# Altium project CtrlCarbinBoard.PrjPCB
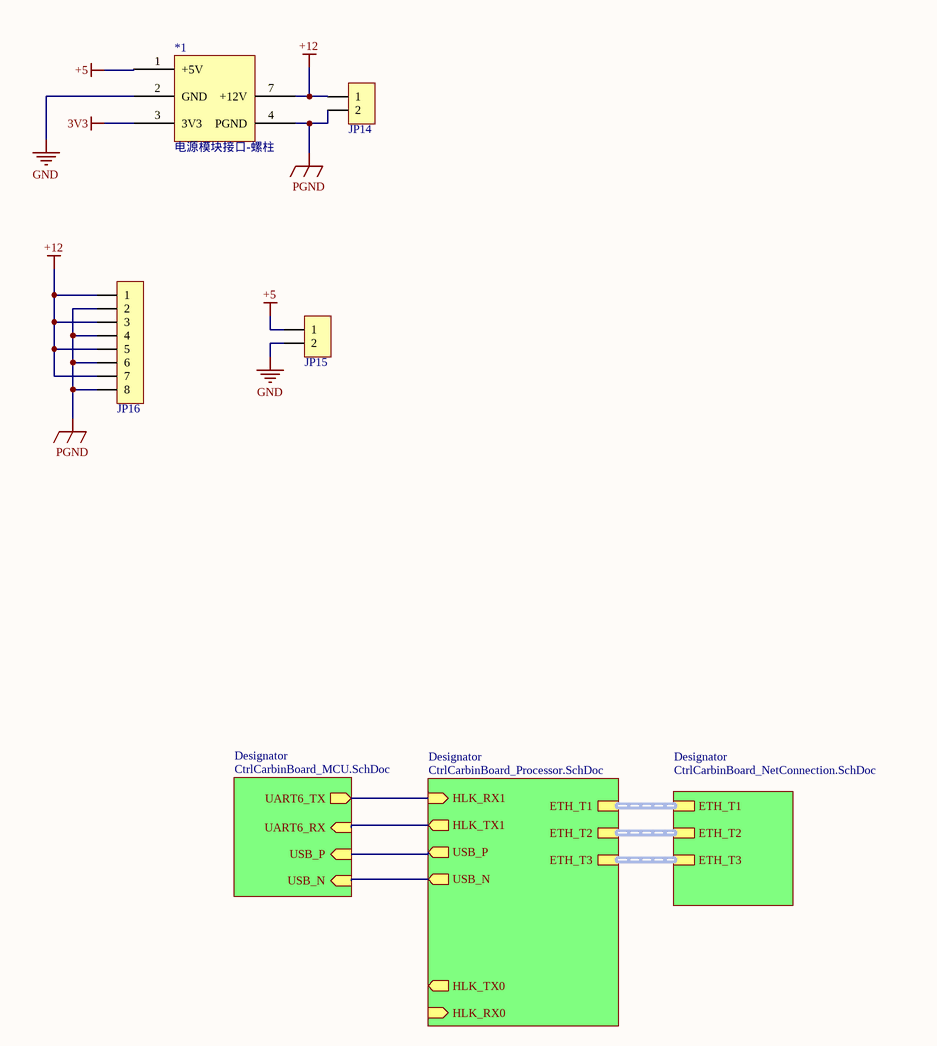
[diagram p0: CtrlCarbinBoard_Common.SchDoc]
4 sheets, 91 parts. Net scope: hierarchical (ports join the sheet entries above them; power ports are global).
Board file: CtrlCarbinBoard.PcbDoc
Sheets:
  CtrlCarbinBoard_Common.SchDoc
    Designator = CtrlCarbinBoard_MCU.SchDoc
    Designator = CtrlCarbinBoard_NetConnection.SchDoc
    Designator = CtrlCarbinBoard_Processor.SchDoc

## Sheet CtrlCarbinBoard_Common.SchDoc
size A3

### Parts
*1  电源模块接口-螺柱  [螺柱-座 5]
JP14  HDR-1X2  [KF128-5.08-2P]  (value not drawn)
JP15  HDR-1X2  [KF128-5.08-2P]  (value not drawn)
JP16  HDR-1X8  [KF128-5.08-8P]  (value not drawn)

### Sub-sheets
Designator = CtrlCarbinBoard_MCU.SchDoc: UART6_TX (out), USB_P (in), USB_N (in), UART6_RX (in)
Designator = CtrlCarbinBoard_NetConnection.SchDoc: ETH_T2 (harness ETH_T2), ETH_T3 (harness ETH_T3), ETH_T1 (harness ETH_T1)
Designator = CtrlCarbinBoard_Processor.SchDoc: HLK_TX0 (out), USB_P (out), HLK_RX1 (in), HLK_RX0 (in), USB_N (out), HLK_TX1 (out), ETH_T2 (harness ETH_T2), ETH_T3 (harness ETH_T3), ETH_T1 (harness ETH_T1)

### Nets
3V3: *1.3(3V3)
+5: *1.1(+5V) JP15.1
+12: *1.7(+12V) JP14.1 JP16.1 JP16.3 JP16.5 JP16.7
GND: *1.2(GND) JP15.2
PGND: *1.4(PGND) JP14.2 JP16.2 JP16.4 JP16.6 JP16.8
RX1: sheet Designator/UART6_TX, sheet Designator/HLK_RX1
TX1: sheet Designator/UART6_RX, sheet Designator/HLK_TX1
USB_D_N: sheet Designator/USB_N, sheet Designator/USB_N
USB_D_P: sheet Designator/USB_P, sheet Designator/USB_P

### Library data of the parts
JP14 JP15 = Header 2: 2P接插件; 版权归属: 源创客; BOM名称: 2P接插件; 学习资源: www.ooocke.com
JP16 = Header 8: 8P接插件; 版权归属: 源创客; BOM名称: 8P接插件; 学习资源: www.ooocke.com

## Sheet CtrlCarbinBoard_MCU.SchDoc
size A3
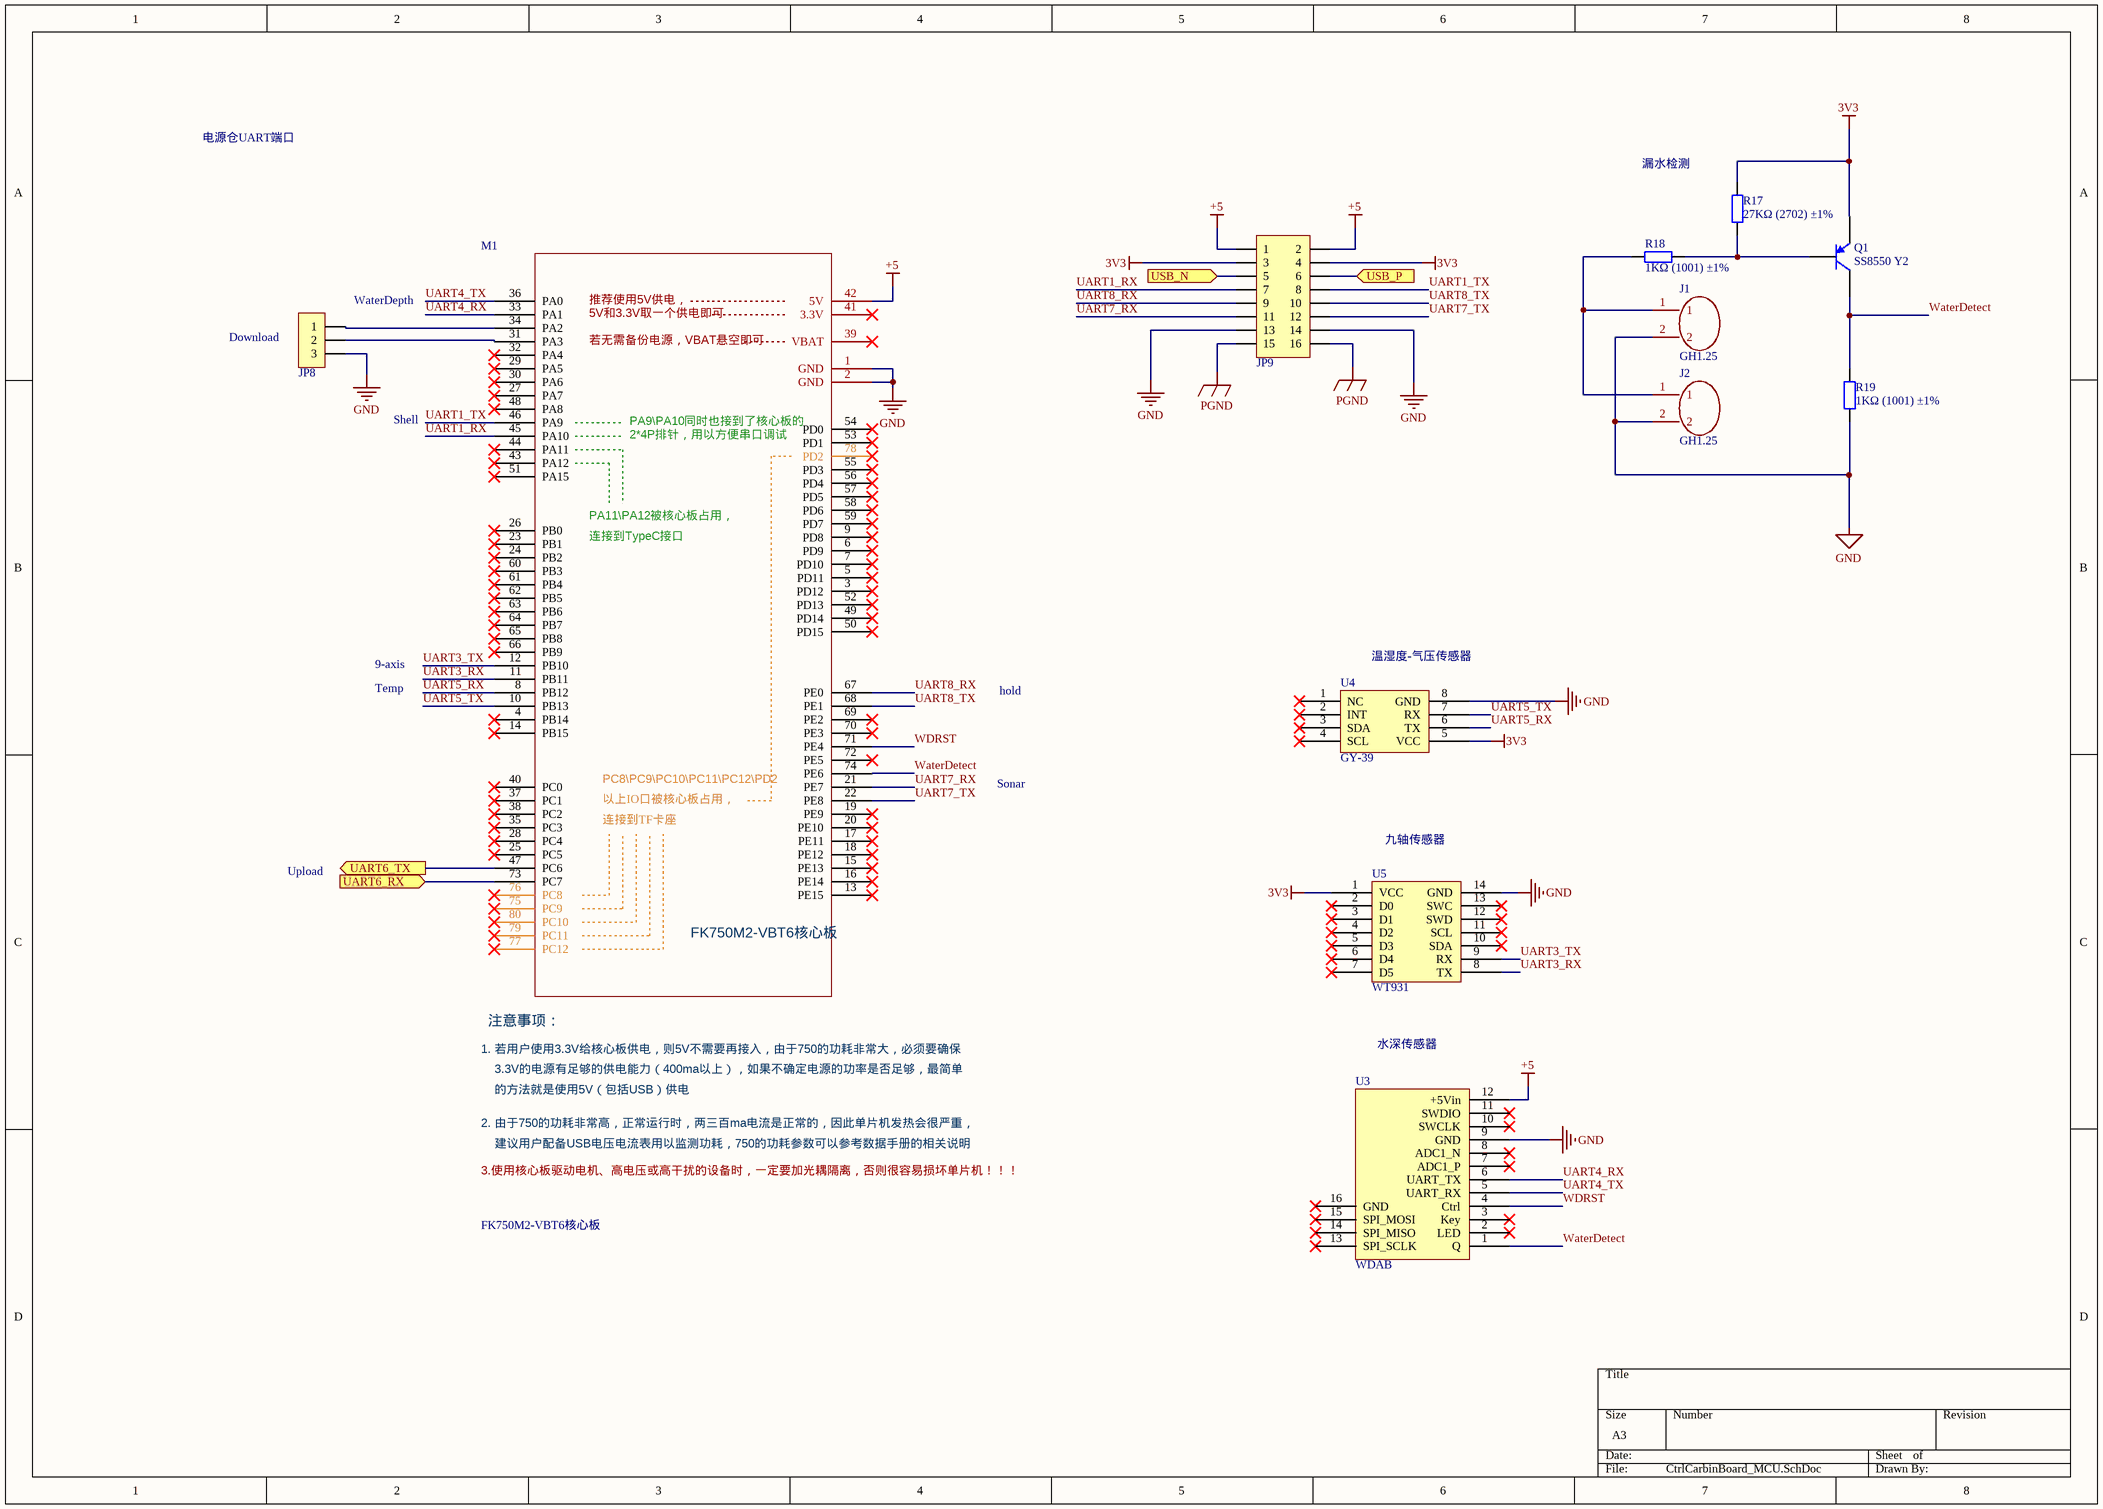
[diagram p1: CtrlCarbinBoard_MCU.SchDoc]

### Parts
J1  GH1.25  [GH1.25 2pin]
J2  GH1.25  [GH1.25 2pin]
JP8  HDR-1X3  [PH2.0-LS-3P]  (value not drawn)
JP9  Header 8X2  [IDC2.54-LI-2x8P]  (value not drawn)
M1  FK750M2-VBT6核心板  [FK750M2-VBT6(精简版)]
Q1  SS8550 Y2  [SOT-23(SOT-23-3)]
R17  27KΩ (2702) ±1%  [0603_R]
R18  1KΩ (1001) ±1%  [0603_R]
R19  1KΩ (1001) ±1%  [0603_R]
U3  WDAB  [WaterDepthBoard]
U4  GY-39  [GY39]
U5  WT931  [WT931]

### Ports
UART6_RX (in), UART6_TX (out), USB_N (in), USB_P (in)

### Nets
3V3: JP9.3 JP9.4 Q1.2(E) R17.2 U4.5(VCC) U5.1(VCC)
+5: JP9.1 JP9.2 M1.42(5V) U3.12(+5Vin)
GND: J1.2 J2.2 JP8.3 JP9.13 JP9.14 M1.1(GND) M1.2(GND) R19.1 U3.9(GND) U4.8(GND) U5.14(GND)
PGND: JP9.15 JP9.16
RX1: M1.47(PC6) ; port UART6_TX
TX1: M1.73(PC7) ; port UART6_RX
UART1_RX: JP9.7 M1.45(PA10)
UART1_TX: JP9.8 M1.46(PA9)
UART3_RX: M1.11(PB11) U5.8(TX)
UART3_TX: M1.12(PB10) U5.9(RX)
UART4_RX: M1.33(PA1) U3.6(UART_TX)
UART4_TX: M1.36(PA0) U3.5(UART_RX)
UART5_RX: M1.8(PB12) U4.6(TX)
UART5_TX: M1.10(PB13) U4.7(RX)
UART7_RX: JP9.11 M1.21(PE7)
UART7_TX: JP9.12 M1.22(PE8)
UART8_RX: JP9.9 M1.67(PE0)
UART8_TX: JP9.10 M1.68(PE1)
USB_D_N: JP9.5 ; port USB_N
USB_D_P: JP9.6 ; port USB_P
WaterDetect: M1.74(PE6) Q1.3(C) R19.2 U3.1(Q)
WDRST: M1.71(PE4) U3.4(Ctrl)
NetJ1_1: J1.1 J2.1 R18.1
NetJP8_1: JP8.1 M1.34(PA2)
NetJP8_2: JP8.2 M1.31(PA3)
NetQ1_1: Q1.1(B) R17.1 R18.2

Not connected (* = marked no-connect by the designer): M1 3(PD12)* 4(PB14)* 5(PD11)* 6(PD9)* 7(PD10)* 9(PD8)* 13(PE15)* 14(PB15)* 15(PE13)* 16(PE14)* 17(PE11)* 18(PE12)* 19(PE9)* 20(PE10)* 23(PB1)* 24(PB2)* 25(PC5)* 26(PB0)* 27(PA7)* 28(PC4)* 29(PA5)* 30(PA6)* 32(PA4)* 35(PC3)* 37(PC1)* 38(PC2)* 39(VBAT)* 40(PC0)* 41(3.3V)* 43(PA12)* 44(PA11)* 48(PA8)* 49(PD14)* 50(PD15)* 51(PA15)* 52(PD13)* 53(PD1)* 54(PD0)* 55(PD3)* 56(PD4)* 57(PD5)* 58(PD6)* 59(PD7)* 60(PB3)* 61(PB4)* 62(PB5)* 63(PB6)* 64(PB7)* 65(PB8)* 66(PB9)* 69(PE2)* 70(PE3)* 72(PE5)* 75(PC9)* 76(PC8)* 77(PC12)* 78(PD2)* 79(PC11)* 80(PC10)*; U3 2(LED)* 3(Key)* 7(ADC1_P)* 8(ADC1_N)* 10(SWCLK)* 11(SWDIO)* 13(SPI_SCLK)* 14(SPI_MISO)* 15(SPI_MOSI)* 16(GND)*; U4 1(NC)* 2(INT)* 3(SDA)* 4(SCL)*; U5 2(D0)* 3(D1)* 4(D2)* 5(D3)* 6(D4)* 7(D5)* 10(SDA)* 11(SCL)* 12(SWD)* 13(SWC)*

### Notes on the sheet
- 电源仓UART端口
- 漏水检测
- (near JP8) WaterDepth
- (near JP8) Download
- Shell
- 9-axis
- Temp
- hold
- (near U4) 温湿度-气压传感器
- Sonar
- (near U5) 九轴传感器
- Upload
- 水深传感器
- (in symbol FK750M2-VBT6) 推荐使用5V供电，; 5V和3.3V取一个供电即可; 若无需备份电源，VBAT悬空即可; PA9\PA10同时也接到了核心板的; 2*4P排针，用以方便串口调试; PA11\PA12被核心板占用，; 连接到TypeC接口; PC8\PC9\PC10\PC11\PC12\PD2; 以上IO口被核心板占用，; 连接到TF卡座; 注意事项：; 1. 若用户使用3.3V给核心板供电，则5V不需要再接入，由于750的功耗非常大，必须要确保; 3.3V的电源有足够的供电能力（400ma以上），如果不确定电源的功率是否足够，最简单; 的方法就是使用5V（包括USB）供电; 2. 由于750的功耗非常高，正常运行时，两三百ma电流是正常的，因此单片机发热会很严重，; 建议用户配备USB电压电流表用以监测功耗，750的功耗参数可以参考数据手册的相关说明; 3.使用核心板驱动电机、高电压或高干扰的设备时，一定要加光耦隔离，否则很容易损坏单片机！！！

### Library data of the parts
J1 J2 = GH1.25 2pin
JP8 = Header 3: 3P接插件; 版权归属: 源创客; BOM名称: 3P接插件; 学习资源: www.ooocke.com
JP9 = Header 8X2: 8*2P接插件; 版权归属: 源创客; BOM名称: 8*2P接插件; 学习资源: www.ooocke.com
M1 = FK750M2-VBT6
Q1 = SOT-23 SS8550 Y2: 三极管; ComponentLink1Description: 供应商链接; ComponentLink1URL: http://www.szlcsc.com/product/details_9037.html; Package: SOT-23; Supplier: LC; SuppliersPartNumber: C8542
R17 = 0603 27KΩ (2702) 1%: 贴片电阻; ComponentLink1Description: 供应商链接; ComponentLink1URL: http://www.szlcsc.com/product/details_23694.html; Package: 0603; Supplier: LC; SuppliersPartNumber: C22967
R18 R19 = 0603 1KΩ (1001) 1%: 贴片电阻; ComponentLink1Description: 供应商链接; ComponentLink1URL: http://www.szlcsc.com/product/details_21904.html; Package: 0603; Supplier: LC; SuppliersPartNumber: C21190
U3 = WaterDepthBoard
U4 = GY39: GY39温湿度大气压光照传感器
U5 = WT931: 维特智能WT931九轴模块

## Sheet CtrlCarbinBoard_NetConnection.SchDoc
size A3
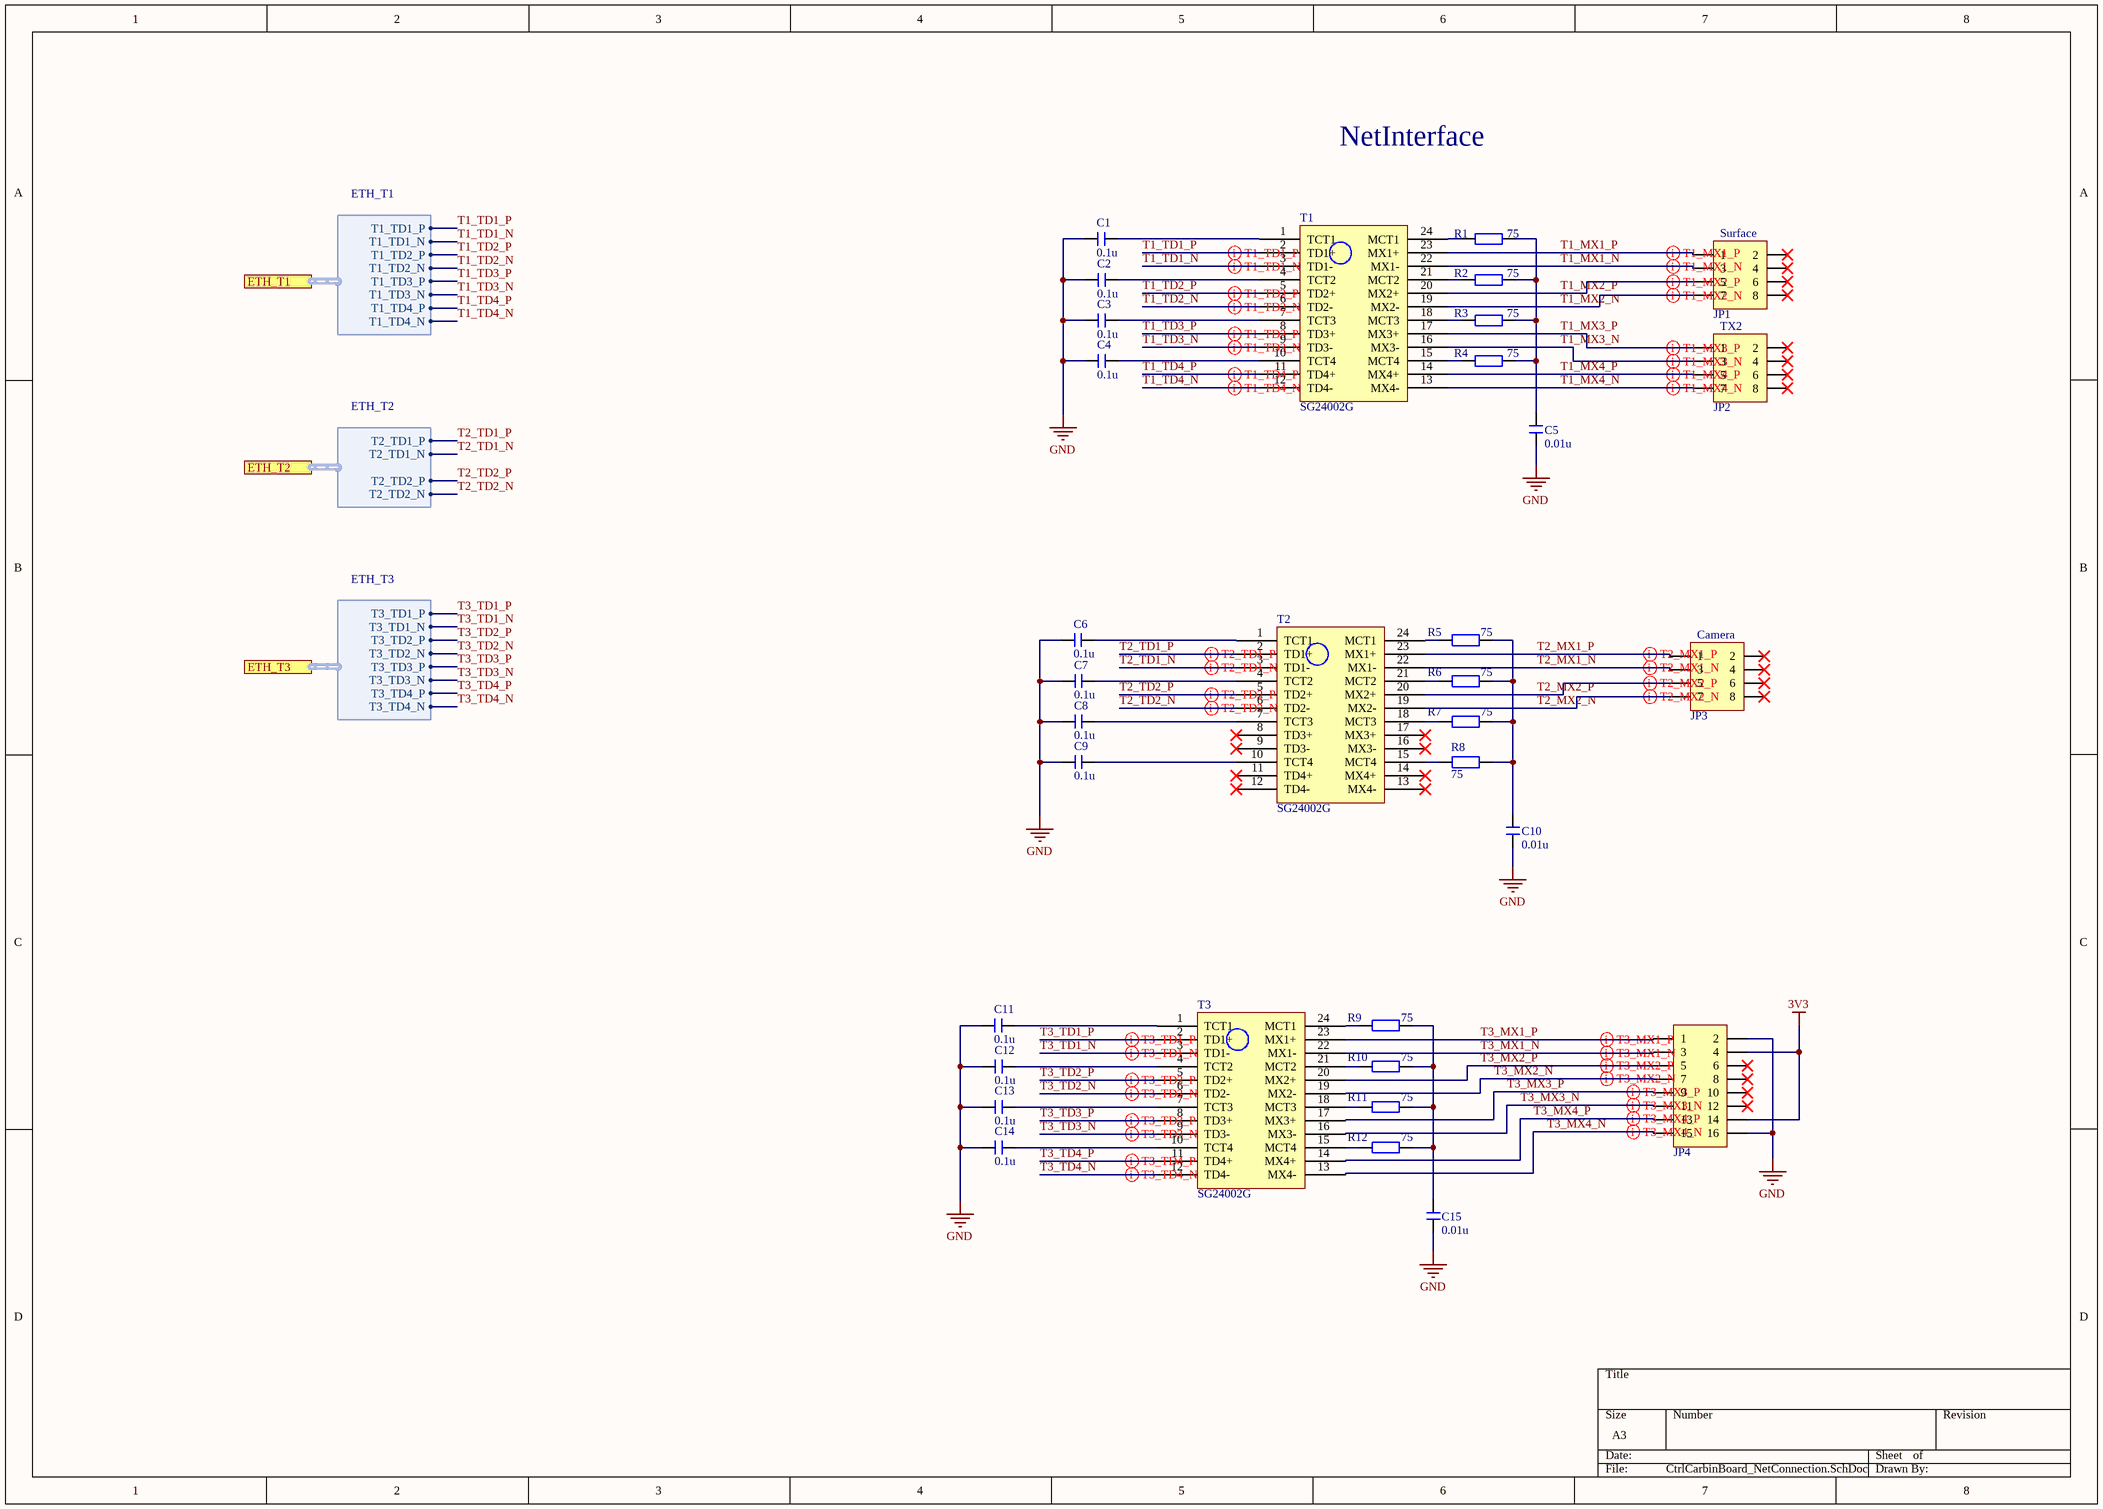
[diagram p2: CtrlCarbinBoard_NetConnection.SchDoc]

### Parts
C1  0.1u  [C 0603_L]
C2  0.1u  [C 0603_L]
C3  0.1u  [C 0603_L]
C4  0.1u  [C 0603_L]
C5  0.01u  [C 0603_M]
C6  0.1u  [C 0603_L]
C7  0.1u  [C 0603_L]
C8  0.1u  [C 0603_L]
C9  0.1u  [C 0603_L]
C10  0.01u  [C 0603_M]
C11  0.1u  [C 0603_L]
C12  0.1u  [C 0603_L]
C13  0.1u  [C 0603_L]
C14  0.1u  [C 0603_L]
C15  0.01u  [C 0603_M]
JP1  Surface  [PHB2.0-LI-2x4P]
JP2  TX2  [PHB2.0-LI-2x4P]
JP3  Camera  [PHB2.0-LI-2x4P]
JP4  Header 8X2  [IDC2.54-LI-2x8P]  (value not drawn)
R1  75  [R 0603_L]
R2  75  [R 0603_L]
R3  75  [R 0603_L]
R4  75  [R 0603_L]
R5  75  [R 0603_L]
R6  75  [R 0603_L]
R7  75  [R 0603_L]
R8  75  [R 0603_L]
R9  75  [R 0603_L]
R10  75  [R 0603_L]
R11  75  [R 0603_L]
R12  75  [R 0603_L]
T1  SG24002G  [SG24002G]
T2  SG24002G  [SG24002G]
T3  SG24002G  [SG24002G]

### Ports
ETH_T1 (harness ETH_T1), ETH_T2 (harness ETH_T2), ETH_T3 (harness ETH_T3)

### Harnesses
ETH_T1: T1_TD1_P, T1_TD1_N, T1_TD2_P, T1_TD2_N, T1_TD3_P, T1_TD3_N, T1_TD4_P, T1_TD4_N
ETH_T2: T2_TD1_P, T2_TD1_N, T2_TD2_P, T2_TD2_N
ETH_T3: T3_TD1_P, T3_TD1_N, T3_TD2_P, T3_TD2_N, T3_TD3_P, T3_TD3_N, T3_TD4_P, T3_TD4_N

### Nets
3V3: JP4.4 JP4.14
GND: C1.1 C2.1 C3.1 C4.1 C5.1 C6.1 C7.1 C8.1 C9.1 C10.1 C11.1 C12.1 C13.1 C14.1 C15.1 JP4.2 JP4.16
T1_MX1_N: JP1.3 T1.22(MX1-)
T1_MX1_P: JP1.1 T1.23(MX1+)
T1_MX2_N: JP1.7 T1.19(MX2-)
T1_MX2_P: JP1.5 T1.20(MX2+)
T1_MX3_N: JP2.3 T1.16(MX3-)
T1_MX3_P: JP2.1 T1.17(MX3+)
T1_MX4_N: JP2.7 T1.13(MX4-)
T1_MX4_P: JP2.5 T1.14(MX4+)
T1_TD1_N: T1.3(TD1-) ; port ETH_T1.T1_TD1_N
T1_TD1_P: T1.2(TD1+) ; port ETH_T1.T1_TD1_P
T1_TD2_N: T1.6(TD2-) ; port ETH_T1.T1_TD2_N
T1_TD2_P: T1.5(TD2+) ; port ETH_T1.T1_TD2_P
T1_TD3_N: T1.9(TD3-) ; port ETH_T1.T1_TD3_N
T1_TD3_P: T1.8(TD3+) ; port ETH_T1.T1_TD3_P
T1_TD4_N: T1.12(TD4-) ; port ETH_T1.T1_TD4_N
T1_TD4_P: T1.11(TD4+) ; port ETH_T1.T1_TD4_P
T2_MX1_N: JP3.3 T2.22(MX1-)
T2_MX1_P: JP3.1 T2.23(MX1+)
T2_MX2_N: JP3.7 T2.19(MX2-)
T2_MX2_P: JP3.5 T2.20(MX2+)
T2_TD1_N: T2.3(TD1-) ; port ETH_T2.T2_TD1_N
T2_TD1_P: T2.2(TD1+) ; port ETH_T2.T2_TD1_P
T2_TD2_N: T2.6(TD2-) ; port ETH_T2.T2_TD2_N
T2_TD2_P: T2.5(TD2+) ; port ETH_T2.T2_TD2_P
T3_MX1_N: JP4.3 T3.22(MX1-)
T3_MX1_P: JP4.1 T3.23(MX1+)
T3_MX2_N: JP4.7 T3.19(MX2-)
T3_MX2_P: JP4.5 T3.20(MX2+)
T3_MX3_N: JP4.11 T3.16(MX3-)
T3_MX3_P: JP4.9 T3.17(MX3+)
T3_MX4_N: JP4.15 T3.13(MX4-)
T3_MX4_P: JP4.13 T3.14(MX4+)
T3_TD1_N: T3.3(TD1-) ; port ETH_T3.T3_TD1_N
T3_TD1_P: T3.2(TD1+) ; port ETH_T3.T3_TD1_P
T3_TD2_N: T3.6(TD2-) ; port ETH_T3.T3_TD2_N
T3_TD2_P: T3.5(TD2+) ; port ETH_T3.T3_TD2_P
T3_TD3_N: T3.9(TD3-) ; port ETH_T3.T3_TD3_N
T3_TD3_P: T3.8(TD3+) ; port ETH_T3.T3_TD3_P
T3_TD4_N: T3.12(TD4-) ; port ETH_T3.T3_TD4_N
T3_TD4_P: T3.11(TD4+) ; port ETH_T3.T3_TD4_P
NetC1_2: C1.2 T1.1(TCT1)
NetC2_2: C2.2 T1.4(TCT2)
NetC3_2: C3.2 T1.7(TCT3)
NetC4_2: C4.2 T1.10(TCT4)
NetC5_2: C5.2 R1.2 R2.2 R3.2 R4.2
NetC6_2: C6.2 T2.1(TCT1)
NetC7_2: C7.2 T2.4(TCT2)
NetC8_2: C8.2 T2.7(TCT3)
NetC9_2: C9.2 T2.10(TCT4)
NetC10_2: C10.2 R5.2 R6.2 R7.2 R8.2
NetC11_2: C11.2 T3.1(TCT1)
NetC12_2: C12.2 T3.4(TCT2)
NetC13_2: C13.2 T3.7(TCT3)
NetC14_2: C14.2 T3.10(TCT4)
NetC15_2: C15.2 R9.2 R10.2 R11.2 R12.2
NetR1_1: R1.1 T1.24(MCT1)
NetR2_1: R2.1 T1.21(MCT2)
NetR3_1: R3.1 T1.18(MCT3)
NetR4_1: R4.1 T1.15(MCT4)
NetR5_1: R5.1 T2.24(MCT1)
NetR6_1: R6.1 T2.21(MCT2)
NetR7_1: R7.1 T2.18(MCT3)
NetR8_1: R8.1 T2.15(MCT4)
NetR9_1: R9.1 T3.24(MCT1)
NetR10_1: R10.1 T3.21(MCT2)
NetR11_1: R11.1 T3.18(MCT3)
NetR12_1: R12.1 T3.15(MCT4)

Not connected (* = marked no-connect by the designer): JP1 2* 4* 6* 8*; JP2 2* 4* 6* 8*; JP3 2* 4* 6* 8*; JP4 6* 8* 10* 12*; T2 8(TD3+)* 9(TD3-)* 11(TD4+)* 12(TD4-)* 13(MX4-)* 14(MX4+)* 16(MX3-)* 17(MX3+)*

### Layout directives
differential pair: T1_MX1_N, T1_MX1_P, T1_MX2_N, T1_MX2_P, T1_MX3_N, T1_MX3_P, T1_MX4_N, T1_MX4_P, T1_TD1_N, T1_TD1_P, T1_TD2_N, T1_TD2_P, T1_TD3_N, T1_TD3_P, T1_TD4_N, T1_TD4_P, T2_MX1_N, T2_MX1_P, T2_MX2_N, T2_MX2_P, T2_TD1_N, T2_TD1_P, T2_TD2_N, T2_TD2_P, T3_MX1_N, T3_MX1_P, T3_MX2_N, T3_MX2_P, T3_MX3_N, T3_MX3_P, T3_MX4_N, T3_MX4_P, T3_TD1_N, T3_TD1_P, T3_TD2_N, T3_TD2_P, T3_TD3_N, T3_TD3_P, T3_TD4_N, T3_TD4_P

### Notes on the sheet
- NetInterface

### Library data of the parts
C1-C15 = C: 无极性贴片电容; 版权归属: 源创客; BOM名称: 无极性贴片电容; 学习资源: www.ooocke.com
JP1-JP3 = Header 4X2: 4*2P接插件; 版权归属: 源创客; BOM名称: 4*2P接插件; 学习资源: www.ooocke.com
JP4 = Header 8X2: 8*2P接插件; 版权归属: 源创客; BOM名称: 8*2P接插件; 学习资源: www.ooocke.com
R1-R12 = R: 贴片电阻; 版权归属: 源创客; BOM名称: 贴片电阻; 学习资源: www.ooocke.com

## Sheet CtrlCarbinBoard_Processor.SchDoc
size A3
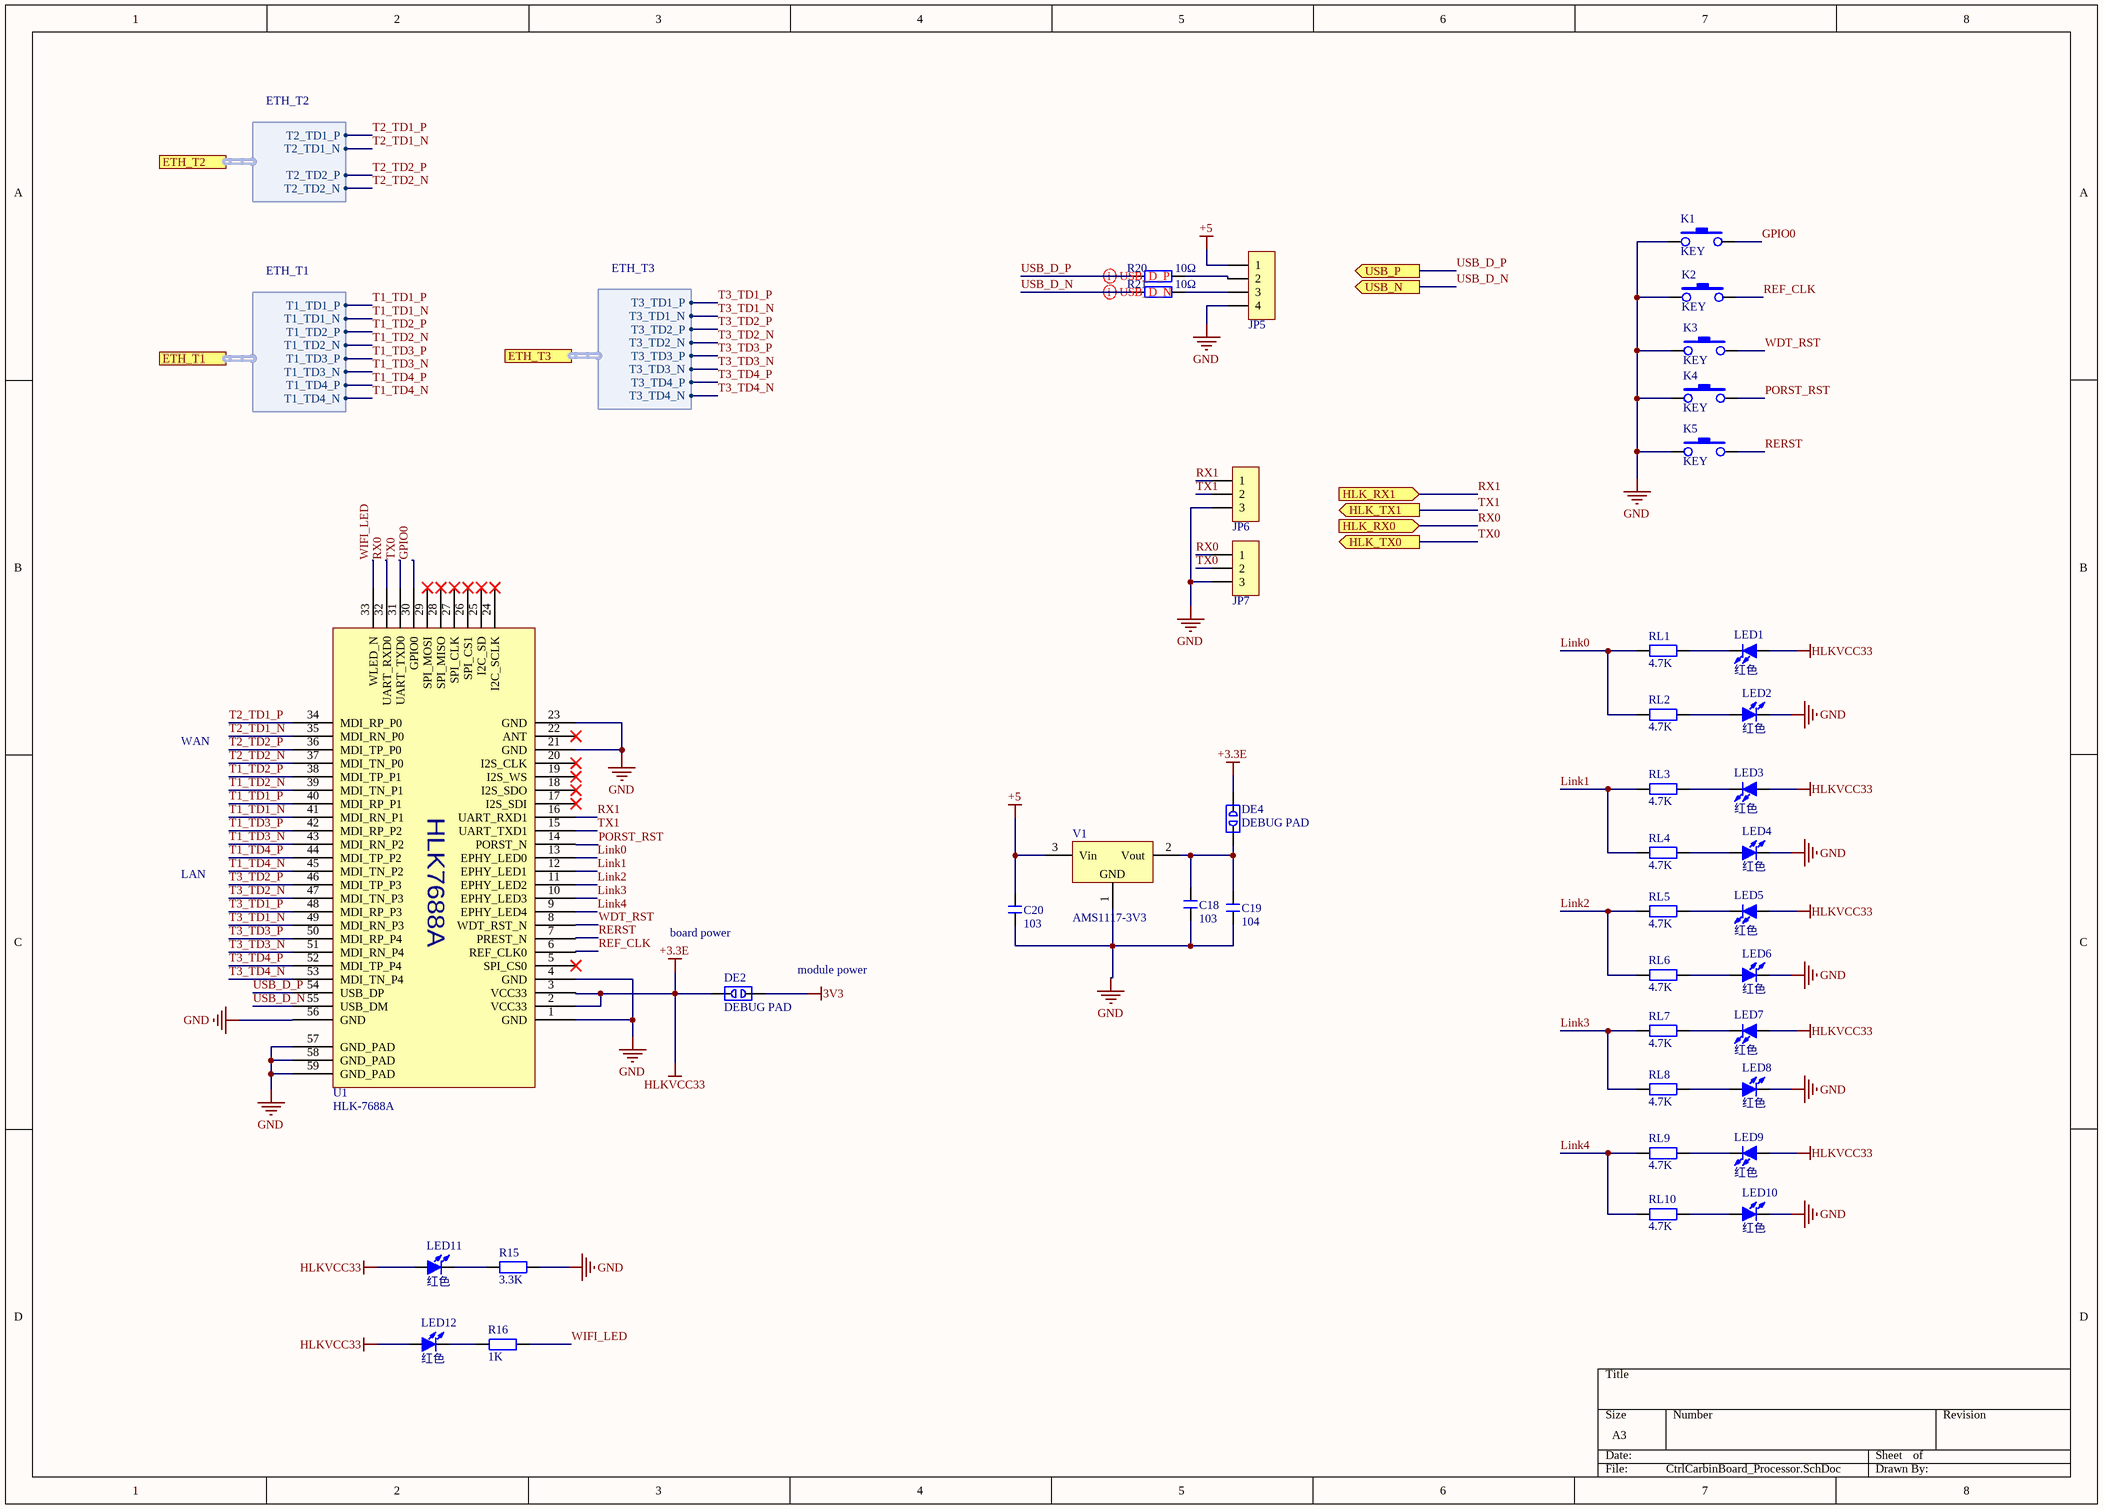
[diagram p3: CtrlCarbinBoard_Processor.SchDoc]

### Parts
C18  103  [C 0603_L]
C19  104  [C 0603_L]
C20  103  [C 0603_L]
DE2  DEBUG PAD  [DEBUG_B]
DE4  DEBUG PAD  [DEBUG_B]
JP5  HDR-1X4  [HDR2.54-LI-4P]  (value not drawn)
JP6  HDR-1X3  [PH2.0-LS-3P]  (value not drawn)
JP7  HDR-1X3  [PH2.0-LS-3P]  (value not drawn)
K1  KEY  [SMD-3X6X2.5]
K2  KEY  [SMD-3X6X2.5]
K3  KEY  [SMD-3X6X2.5]
K4  KEY  [SMD-3X6X2.5]
K5  KEY  [SMD-3X6X2.5]
LED1  红色  [LED 0603R]
LED2  红色  [LED 0603R]
LED3  红色  [LED 0603R]
LED4  红色  [LED 0603R]
LED5  红色  [LED 0603R]
LED6  红色  [LED 0603R]
LED7  红色  [LED 0603R]
LED8  红色  [LED 0603R]
LED9  红色  [LED 0603R]
LED10  红色  [LED 0603R]
LED11  红色  [LED 0805G]
LED12  红色  [LED 0805G]
R15  3.3K  [R 0603_L]
R16  1K  [R 0603_L]
R20  10Ω  [R 0603_L]
R21  10Ω  [R 0603_L]
RL1  4.7K  [R 0603_L]
RL2  4.7K  [R 0603_L]
RL3  4.7K  [R 0603_L]
RL4  4.7K  [R 0603_L]
RL5  4.7K  [R 0603_L]
RL6  4.7K  [R 0603_L]
RL7  4.7K  [R 0603_L]
RL8  4.7K  [R 0603_L]
RL9  4.7K  [R 0603_L]
RL10  4.7K  [R 0603_L]
U1  HLK-7688A  [7688A]
V1  AMS1117-3V3  [SOT223_M]

### Ports
ETH_T1 (harness ETH_T1), ETH_T2 (harness ETH_T2), ETH_T3 (harness ETH_T3), HLK_RX0 (in), HLK_RX1 (in), HLK_TX0 (out), HLK_TX1 (out), USB_N (out), USB_P (out)

### Harnesses
ETH_T1: T1_TD1_P, T1_TD1_N, T1_TD2_P, T1_TD2_N, T1_TD3_P, T1_TD3_N, T1_TD4_P, T1_TD4_N
ETH_T2: T2_TD1_P, T2_TD1_N, T2_TD2_P, T2_TD2_N
ETH_T3: T3_TD1_P, T3_TD1_N, T3_TD2_P, T3_TD2_N, T3_TD3_P, T3_TD3_N, T3_TD4_P, T3_TD4_N

### Nets
3V3: DE2.2
+3.3E: DE2.1 DE4.2 LED1.1(A) LED3.1(A) LED5.1(A) LED7.1(A) LED9.1(A) LED11.1(A) LED12.1(A) U1.2(VCC33) U1.3(VCC33)  [also labelled HLKVCC33]
+5: C20.2 JP5.1 V1.3(Vin)
GND: C18.1 C19.1 C20.1 JP5.4 JP6.3 JP7.3 K1.1 K2.1 K3.1 K4.1 K5.1 LED2.2(K) LED4.2(K) LED6.2(K) LED8.2(K) LED10.2(K) R15.2 U1.1(GND) U1.4(GND) U1.21(GND) U1.23(GND) U1.56(GND) U1.57(GND_PAD) U1.58(GND_PAD) U1.59(GND_PAD) V1.1(GND)
GPIO0: K1.3 U1.30(GPIO0)
Link0: RL1.2 RL2.2 U1.13(EPHY_LED0)
Link1: RL3.2 RL4.2 U1.12(EPHY_LED1)
Link2: RL5.2 RL6.2 U1.11(EPHY_LED2)
Link3: RL7.2 RL8.2 U1.10(EPHY_LED3)
Link4: RL9.2 RL10.2 U1.9(EPHY_LED4)
PORST_RST: K4.3 U1.14(PORST_N)
REF_CLK: K2.3 U1.6(REF_CLK0)
RERST: K5.3 U1.7(PREST_N)
RX0: JP7.1 U1.32(UART_RXD0) ; port HLK_RX0
RX1: JP6.1 U1.16(UART_RXD1) ; port HLK_RX1
T1_TD1_N: U1.41(MDI_RN_P1) ; port ETH_T1.T1_TD1_N
T1_TD1_P: U1.40(MDI_RP_P1) ; port ETH_T1.T1_TD1_P
T1_TD2_N: U1.39(MDI_TN_P1) ; port ETH_T1.T1_TD2_N
T1_TD2_P: U1.38(MDI_TP_P1) ; port ETH_T1.T1_TD2_P
T1_TD3_N: U1.43(MDI_RN_P2) ; port ETH_T1.T1_TD3_N
T1_TD3_P: U1.42(MDI_RP_P2) ; port ETH_T1.T1_TD3_P
T1_TD4_N: U1.45(MDI_TN_P2) ; port ETH_T1.T1_TD4_N
T1_TD4_P: U1.44(MDI_TP_P2) ; port ETH_T1.T1_TD4_P
T2_TD1_N: U1.35(MDI_RN_P0) ; port ETH_T2.T2_TD1_N
T2_TD1_P: U1.34(MDI_RP_P0) ; port ETH_T2.T2_TD1_P
T2_TD2_N: U1.37(MDI_TN_P0) ; port ETH_T2.T2_TD2_N
T2_TD2_P: U1.36(MDI_TP_P0) ; port ETH_T2.T2_TD2_P
T3_TD1_N: U1.49(MDI_RN_P3) ; port ETH_T3.T3_TD1_N
T3_TD1_P: U1.48(MDI_RP_P3) ; port ETH_T3.T3_TD1_P
T3_TD2_N: U1.47(MDI_TN_P3) ; port ETH_T3.T3_TD2_N
T3_TD2_P: U1.46(MDI_TP_P3) ; port ETH_T3.T3_TD2_P
T3_TD3_N: U1.51(MDI_RN_P4) ; port ETH_T3.T3_TD3_N
T3_TD3_P: U1.50(MDI_RP_P4) ; port ETH_T3.T3_TD3_P
T3_TD4_N: U1.53(MDI_TN_P4) ; port ETH_T3.T3_TD4_N
T3_TD4_P: U1.52(MDI_TP_P4) ; port ETH_T3.T3_TD4_P
TX0: JP7.2 U1.31(UART_TXD0) ; port HLK_TX0
TX1: JP6.2 U1.15(UART_TXD1) ; port HLK_TX1
USB_D_N: R21.1 U1.55(USB_DM) ; port USB_N
USB_D_P: R20.1 U1.54(USB_DP) ; port USB_P
WDT_RST: K3.3 U1.8(WDT_RST_N)
WIFI_LED: R16.2 U1.33(WLED_N)
NetC18_2: C18.2 C19.2 DE4.1 V1.2(Vout)
NetJP5_2: JP5.2 R20.2
NetJP5_3: JP5.3 R21.2
NetLED1_2: LED1.2(K) RL1.1
NetLED2_1: LED2.1(A) RL2.1
NetLED3_2: LED3.2(K) RL3.1
NetLED4_1: LED4.1(A) RL4.1
NetLED5_2: LED5.2(K) RL5.1
NetLED6_1: LED6.1(A) RL6.1
NetLED7_2: LED7.2(K) RL7.1
NetLED8_1: LED8.1(A) RL8.1
NetLED9_2: LED9.2(K) RL9.1
NetLED10_1: LED10.1(A) RL10.1
NetLED11_2: LED11.2(K) R15.1
NetLED12_2: LED12.2(K) R16.1

Not connected (* = marked no-connect by the designer): U1 5(SPI_CS0)* 17(I2S_SDI)* 18(I2S_SDO)* 19(I2S_WS)* 20(I2S_CLK)* 22(ANT)* 24(I2C_SCLK)* 25(I2C_SD)* 26(SPI_CS1)* 27(SPI_CLK)* 28(SPI_MISO)* 29(SPI_MOSI)*

### Layout directives
differential pair: USB_D_N, USB_D_P

### Notes on the sheet
- WAN
- LAN
- (near DE2) board power
- module power
- (in symbol HLK-7688A) HLK7688A

### Library data of the parts
C18-C20 = C: 无极性贴片电容; 版权归属: 源创客; BOM名称: 无极性贴片电容; 学习资源: www.ooocke.com
DE2 DE4 = DEBUG: 调试断点焊盘; 版权归属: 源创客; BOM名称: 调试断点焊盘; 学习资源: www.ooocke.com
JP5 = Header 4: 4P接插件; 版权归属: 源创客; BOM名称: 4P接插件; 学习资源: www.ooocke.com
JP6 JP7 = Header 3: 3P接插件; 版权归属: 源创客; BOM名称: 3P接插件; 学习资源: www.ooocke.com
LED1-LED12 = LED-SMD: 贴片LED; 版权归属: 源创客; BOM名称: 贴片LED; 学习资源: www.ooocke.com
R15 R16 R20 R21 RL1-RL10 = R: 贴片电阻; 版权归属: 源创客; BOM名称: 贴片电阻; 学习资源: www.ooocke.com
V1 = AMS1117: 三端稳压芯片; BOM名称: 稳压芯片; 版权归属: 源创客; 学习资源: www.ooocke.com

## Nets that join several sheets
3V3: CtrlCarbinBoard_Common (*1.3), CtrlCarbinBoard_MCU (6 pins), CtrlCarbinBoard_NetConnection (JP4.4 JP4.14), CtrlCarbinBoard_Processor (DE2.2)
+5: CtrlCarbinBoard_Common (*1.1 JP15.1), CtrlCarbinBoard_MCU (JP9.1 JP9.2 M1.42 U3.12), CtrlCarbinBoard_Processor (C20.2 JP5.1 V1.3)
GND: CtrlCarbinBoard_Common (*1.2 JP15.2), CtrlCarbinBoard_MCU (11 pins), CtrlCarbinBoard_NetConnection (17 pins), CtrlCarbinBoard_Processor (26 pins)
PGND: CtrlCarbinBoard_Common (6 pins), CtrlCarbinBoard_MCU (JP9.15 JP9.16)
RX1: CtrlCarbinBoard_MCU (M1.47), CtrlCarbinBoard_Processor (JP6.1 U1.16)
T1_TD1_N: CtrlCarbinBoard_NetConnection (T1.3), CtrlCarbinBoard_Processor (U1.41)
T1_TD1_P: CtrlCarbinBoard_NetConnection (T1.2), CtrlCarbinBoard_Processor (U1.40)
T1_TD2_N: CtrlCarbinBoard_NetConnection (T1.6), CtrlCarbinBoard_Processor (U1.39)
T1_TD2_P: CtrlCarbinBoard_NetConnection (T1.5), CtrlCarbinBoard_Processor (U1.38)
T1_TD3_N: CtrlCarbinBoard_NetConnection (T1.9), CtrlCarbinBoard_Processor (U1.43)
T1_TD3_P: CtrlCarbinBoard_NetConnection (T1.8), CtrlCarbinBoard_Processor (U1.42)
T1_TD4_N: CtrlCarbinBoard_NetConnection (T1.12), CtrlCarbinBoard_Processor (U1.45)
T1_TD4_P: CtrlCarbinBoard_NetConnection (T1.11), CtrlCarbinBoard_Processor (U1.44)
T2_TD1_N: CtrlCarbinBoard_NetConnection (T2.3), CtrlCarbinBoard_Processor (U1.35)
T2_TD1_P: CtrlCarbinBoard_NetConnection (T2.2), CtrlCarbinBoard_Processor (U1.34)
T2_TD2_N: CtrlCarbinBoard_NetConnection (T2.6), CtrlCarbinBoard_Processor (U1.37)
T2_TD2_P: CtrlCarbinBoard_NetConnection (T2.5), CtrlCarbinBoard_Processor (U1.36)
T3_TD1_N: CtrlCarbinBoard_NetConnection (T3.3), CtrlCarbinBoard_Processor (U1.49)
T3_TD1_P: CtrlCarbinBoard_NetConnection (T3.2), CtrlCarbinBoard_Processor (U1.48)
T3_TD2_N: CtrlCarbinBoard_NetConnection (T3.6), CtrlCarbinBoard_Processor (U1.47)
T3_TD2_P: CtrlCarbinBoard_NetConnection (T3.5), CtrlCarbinBoard_Processor (U1.46)
T3_TD3_N: CtrlCarbinBoard_NetConnection (T3.9), CtrlCarbinBoard_Processor (U1.51)
T3_TD3_P: CtrlCarbinBoard_NetConnection (T3.8), CtrlCarbinBoard_Processor (U1.50)
T3_TD4_N: CtrlCarbinBoard_NetConnection (T3.12), CtrlCarbinBoard_Processor (U1.53)
T3_TD4_P: CtrlCarbinBoard_NetConnection (T3.11), CtrlCarbinBoard_Processor (U1.52)
TX1: CtrlCarbinBoard_MCU (M1.73), CtrlCarbinBoard_Processor (JP6.2 U1.15)
USB_D_N: CtrlCarbinBoard_MCU (JP9.5), CtrlCarbinBoard_Processor (R21.1 U1.55)
USB_D_P: CtrlCarbinBoard_MCU (JP9.6), CtrlCarbinBoard_Processor (R20.1 U1.54)